# EAGLE design MainBorad_ver2_1 (EAGLE 9.6.2)
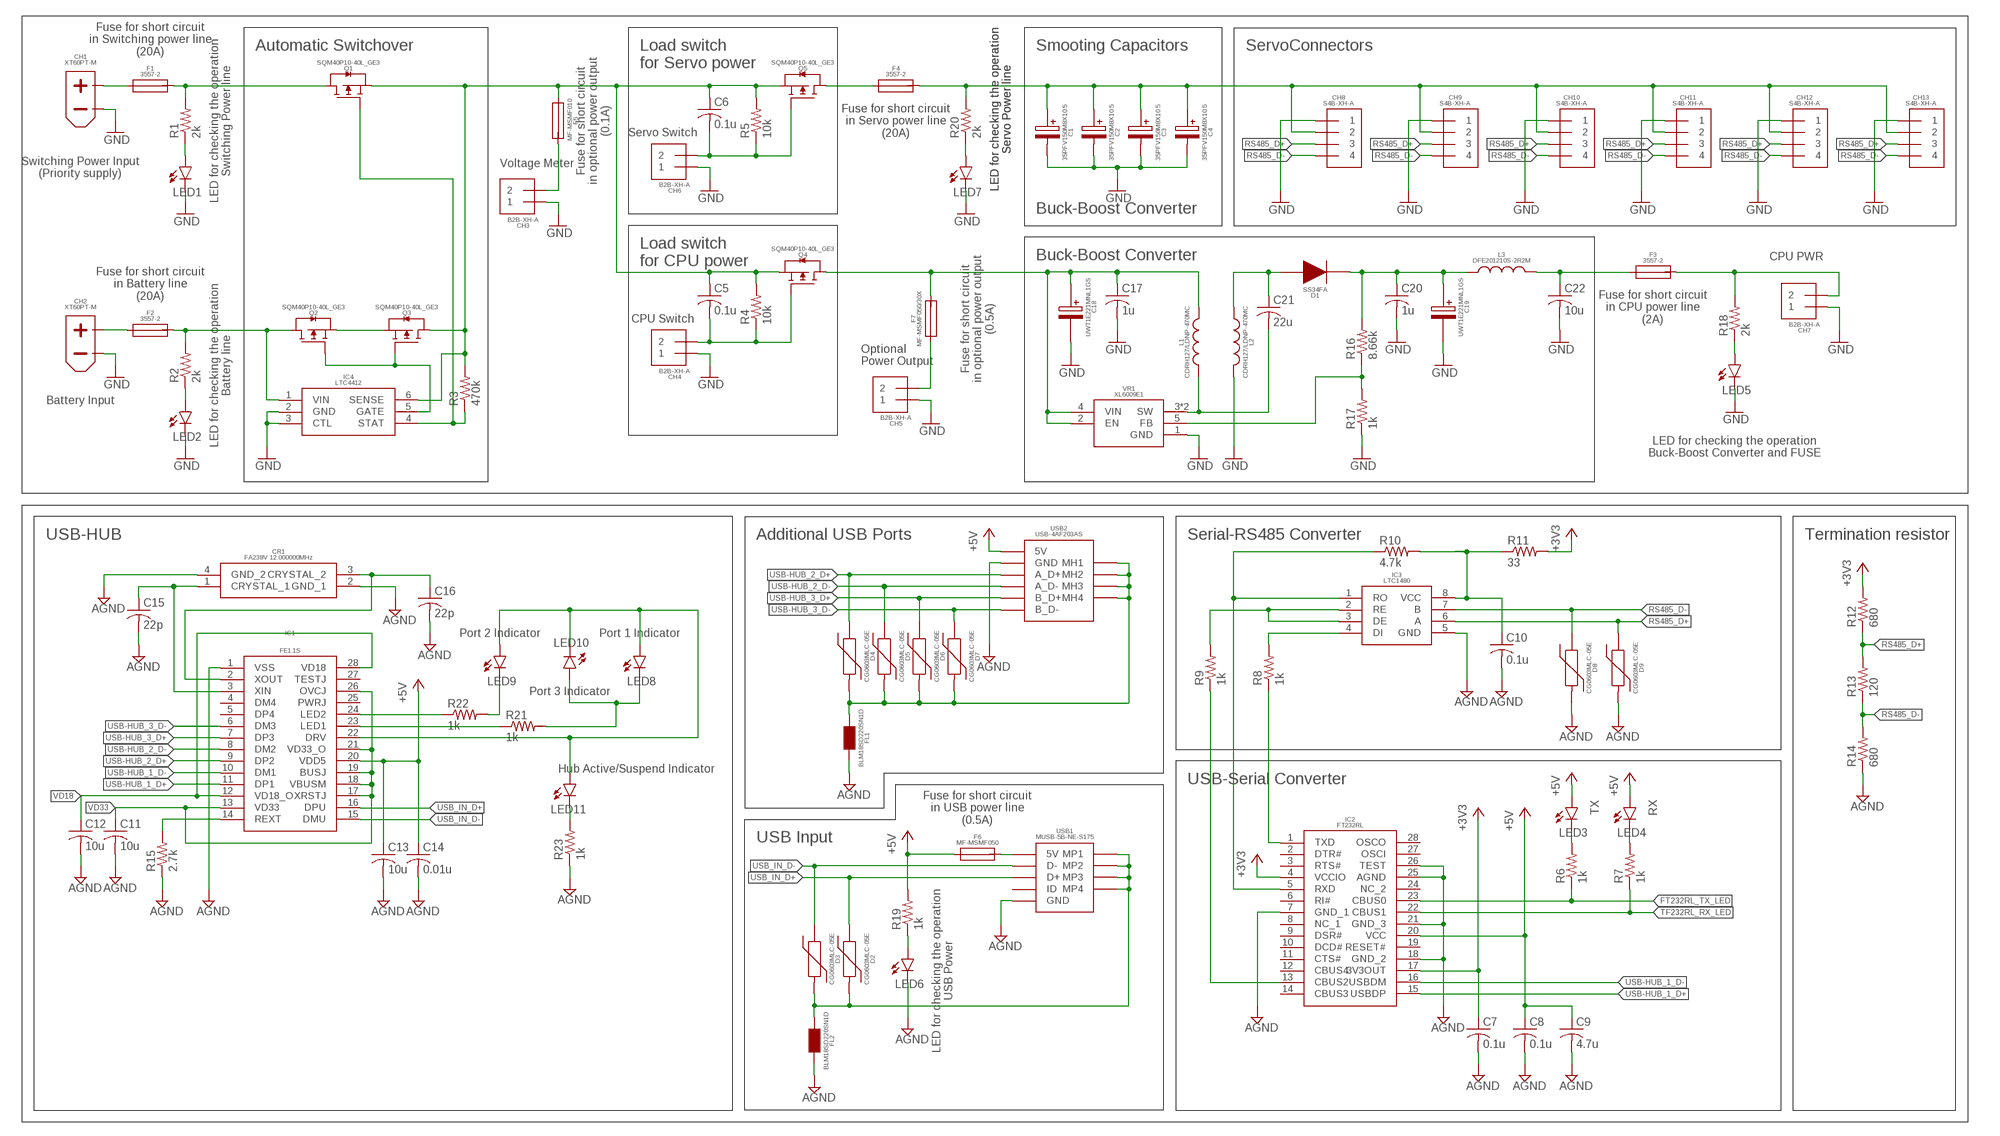
[diagram p0: schematic, sheet 1]

## Parts
C1  35PFV150M8X10.5  [35PFV150M8X10.5]
C2  35PFV150M8X10.5  [35PFV150M8X10.5]
C3  35PFV150M8X10.5  [35PFV150M8X10.5]
C4  35PFV150M8X10.5  [35PFV150M8X10.5]
C5  0.1u  C-USC0603  [C0603]
C6  0.1u  C-USC0603  [C0603]
C7  0.1u  C-USC0603  [C0603]
C8  0.1u  C-USC0603  [C0603]
C9  4.7u  C-USC0603  [C0603]
C10  0.1u  C-USC0603  [C0603]
C11  10u  C-USC0603  [C0603]
C12  10u  C-USC0603  [C0603]
C13  10u  C-USC0603  [C0603]
C14  0.01u  C-USC0603  [C0603]
C15  22p  C-USC0603  [C0603]
C16  22p  C-USC0603  [C0603]
C17  1u  C-USC0603  [C0603]
C18  UWT1E221MNL1GS  [UWT1E221MNL1GS]
C19  UWT1E221MNL1GS  [UWT1E221MNL1GS]
C20  1u  C-USC0603  [C0603]
C21  22u  C-USC2012  [C2012]
C22  10u  C-USC0603  [C0603]
CH1  XT60PT-M  [XT60PT-M]
CH2  XT60PT-M  [XT60PT-M]
CH3  B2B-XH-A  [B2B-XH-A]
CH4  B2B-XH-A  [B2B-XH-A]
CH5  B2B-XH-A  [B2B-XH-A]
CH6  B2B-XH-A  [B2B-XH-A]
CH7  B2B-XH-A  [B2B-XH-A]
CH8  S4B-XH-A  [S4B-XH-A]
CH9  S4B-XH-A  [S4B-XH-A]
CH10  S4B-XH-A  [S4B-XH-A]
CH11  S4B-XH-A  [S4B-XH-A]
CH12  S4B-XH-A  [S4B-XH-A]
CH13  S4B-XH-A  [S4B-XH-A]
CR1  FA238V_12.000000MHZ  [FA238V]
D1  SS34FA  [SS34FA]
D2  CG0603MLC-05E  [CG0603MLC-05E]
D3  CG0603MLC-05E  [CG0603MLC-05E]
D4  CG0603MLC-05E  [CG0603MLC-05E]
D5  CG0603MLC-05E  [CG0603MLC-05E]
D6  CG0603MLC-05E  [CG0603MLC-05E]
D7  CG0603MLC-05E  [CG0603MLC-05E]
D8  CG0603MLC-05E  [CG0603MLC-05E]
D9  CG0603MLC-05E  [CG0603MLC-05E]
F1  3557-2  [3557-2]
F2  3557-2  [3557-2]
F3  3557-2  [3557-2]
F4  3557-2  [3557-2]
F5  MF-MSMF010  [MF-MSMF010]
F6  MF-MSMF050  [MF-MSMF050]
F7  MF-MSMF050/30X  [MF-MSMF050]
FL1  BLM18SD220SN1D  [BLM18SD220SN1D]
FL2  BLM18SD220SN1D  [BLM18SD220SN1D]
IC1  FE1.1S  [FE1.1S]
IC2  FT232RL  [FT232RL]
IC3  LTC1480  [LTC1480]
IC4  LTC4412  [LTC4412]
L1  CDRH127/LDNP-470MC  [CDRH127/LDNP]
L2  CDRH127/LDNP-470MC  [CDRH127/LDNP]
L3  DFE201210S-2R2M  [DFE201210S]
LED1  LEDSML0603  [SML0603]
LED2  LEDSML0603  [SML0603]
LED3  LEDSML0603  [SML0603]
LED4  LEDSML0603  [SML0603]
LED5  LEDSML0603  [SML0603]
LED6  LEDSML0603  [SML0603]
LED7  LEDSML0603  [SML0603]
LED8  LEDSML0603  [SML0603]
LED9  LEDSML0603  [SML0603]
LED10  LEDSML0603  [SML0603]
LED11  LEDSML0603  [SML0603]
Q1  SQM40P10-40L_GE3  [TO-252-3]
Q2  SQM40P10-40L_GE3  [TO-252-3]
Q3  SQM40P10-40L_GE3  [TO-252-3]
Q4  SQM40P10-40L_GE3  [TO-252-3]
Q5  SQM40P10-40L_GE3  [TO-252-3]
R1  2k  R-US_R0603  [R0603]
R2  2k  R-US_R0603  [R0603]
R3  470k  R-US_R0603  [R0603]
R4  10k  R-US_R0603  [R0603]
R5  10k  R-US_R0603  [R0603]
R6  1k  R-US_R0603  [R0603]
R7  1k  R-US_R0603  [R0603]
R8  1k  R-US_R0603  [R0603]
R9  1k  R-US_R0603  [R0603]
R10  4.7k  R-US_R0603  [R0603]
R11  33  R-US_R0603  [R0603]
R12  680  R-US_R0603  [R0603]
R13  120  R-US_R0603  [R0603]
R14  680  R-US_R0603  [R0603]
R15  2.7k  R-US_R0603  [R0603]
R16  8.66k  R-US_R0603  [R0603]
R17  1k  R-US_R0603  [R0603]
R18  2k  R-US_R0603  [R0603]
R19  1k  R-US_R0603  [R0603]
R20  2k  R-US_R0603  [R0603]
R21  1k  R-US_R0603  [R0603]
R22  1k  R-US_R0603  [R0603]
R23  1k  R-US_R0603  [R0603]
USB1  MINI_USB_5P_B_TYPE  [MINI_USB_5P_B_TYPE]
USB2  USB_4P_A_TYPE_X2  [USB_4P_A_TYPE_X2]
VR1  XL6009E1  [TO263-5L]

## Nets
+3V3 [USB-Power]: C7.1 IC2.4(VCCIO) IC2.17(3V3OUT) R11.2 R12.2
+5V [USB-Power]: C8.1 C9.1 C13.1 C14.1 F6.1 IC1.20(VDD5) IC2.20(VCC) LED3.A LED4.A R19.2 USB2.4(5V) USB2.8(5V)
A_DIODE_DCDC [DCDC-Power]: C19.+ C20.1 D1.1 L3.1 R16.2
A_FUSE_BATT [Battery-Power]: F2.3 F2.4 IC4.1(VIN) Q2.4(D) R2.2
A_FUSE_DCDC [DCDC-Power]: CH7.2 F3.3 F3.4 R18.2
A_FUSE_METER [Meter]: CH3.2 F5.2
A_FUSE_PWR [Battery-Power]: F1.3 F1.4 Q1.4(D) R1.2
A_FUSE_SERVO [Battery-Power]: C1.+ C2.+ C3.+ C4.+ CH8.2 CH9.2 CH10.2 CH11.2 CH12.2 CH13.2 F4.3 F4.4 R20.2
AGND [USB-Power]: C7.2 C8.2 C9.2 C10.2 C11.2 C12.2 C13.2 C14.2 C15.2 C16.2 CR1.2(GND_1) CR1.4(GND_2) D8.2 D9.2 FL1.2 FL2.2 IC1.1(VSS) IC2.7(GND_1) IC2.18(GND_2) IC2.21(GND_3) IC2.25(AGND) IC2.26(TEST) IC3.5(GND) LED6.C R14.1 R15.1 R23.1 USB1.5(GND) USB2.1(GND) USB2.5(GND)
B_DIODE_DCDC [DCDC-Power]: C21.1 D1.2 L2.1
B_FUSE_BATT [FUSE-Power]: CH2.+ F2.1 F2.2
B_FUSE_DCDC [DCDC-Power]: C22.1 F3.1 F3.2 L3.2
B_FUSE_PWR [FUSE-Power]: CH1.+ F1.1 F1.2
B_FUSE_SERVO [Battery-Power]: F4.1 F4.2 Q5.4(D)
B_FUSE_USB_MINI_B [USB-Power]: F6.2 USB1.1(5V)
B_LOAD_CPU [Power_Switching]: C5.2 CH4.2 Q4.1(G) R4.1
B_LOAD_SERVO [Power_Switching]: C6.2 CH6.2 Q5.1(G) R5.1
CPU_PWR_IN [CPU-Power]: C17.1 C18.+ F7.2 L1.2 Q4.4(D) VR1.2(EN) VR1.4(VIN)
EN [USB-Data]: IC3.2(RE) IC3.3(DE) R9.2
FB_DCDC [DCDC-Power]: R16.1 R17.2 VR1.5(FB)
FE1.1S_DRV [USB-Power]: IC1.22(DRV) LED8.A LED9.A LED10.C LED11.A
FE1.1S_DRV_LED_A [USB-Power]: LED11.C R23.2
FE1.1S_LED1_A [USB-Power]: LED8.C LED10.A R21.2
FE1.1S_LED_1_B [USB-Power]: IC1.23(LED1) R21.1
FE1.1S_LED_2_A [USB-Power]: LED9.C R22.2
FE1.1S_LED_2_B [USB-Power]: IC1.24(LED2) R22.1
FT232RL_CBUS2 [USB-Data]: IC2.13(CBUS2) R9.1
FT232RL_RXD [USB-Data]: IC2.5(RXD) IC3.1(RO) R10.1
FT232RL_TX_LED [USB-Power]: IC2.23(CBUS0) R6.1
FT232RL_TXD [USB-Data]: IC2.1(TXD) R8.1
GND [Battery-Power]: C1.- C2.- C3.- C4.- C17.2 C18.- C19.- C20.2 C22.2 CH1.- CH2.- CH3.1 CH4.1 CH5.1 CH6.1 CH7.1 CH8.1 CH9.1 CH10.1 CH11.1 CH12.1 CH13.1 IC4.2(GND) IC4.3(CTL) L2.2 LED1.C LED2.C LED5.C LED7.C R17.1 VR1.1(GND)
INPUT_PWR [Battery-Power]: C5.1 C6.1 F5.1 IC4.6(SENSE) Q1.3(S) Q3.4(D) Q4.3(S) Q5.3(S) R3.2 R4.2 R5.2
LED_BATT [LED]: LED2.A R2.1
LED_DCDCOUT [LED]: LED5.A R18.1
LED_FT232RL_RX [USB-Power]: LED4.C R7.2
LED_FT232RL_TX [USB-Power]: LED3.C R6.2
LED_PWR [LED]: LED1.A R1.1
LED_SERVO [LED]: LED7.A R20.1
LED_USBIN [USB-Power]: LED6.A R19.1
LTC1480_DI [USB-Data]: IC3.4(DI) R8.2
LTC1480_VCC [USB-Power]: C10.1 IC3.8(VCC) R10.2 R11.1
LTC4412_GATE [Power_Switching]: IC4.5(GATE) Q2.1(G) Q3.1(G)
LTC4412_STAT [Power_Switching]: IC4.4(STAT) Q1.1(G) R3.1
POWER_OUTPUT [PowerOutput]: CH5.2 F7.1
REXT_FE1.1S [USB-Data]: IC1.14(REXT) R15.2
RS485_D+ [USB-Data]: CH8.3 CH9.3 CH10.3 CH11.3 CH12.3 CH13.3 D9.1 IC3.6(A) R12.1 R13.2
RS485_D- [USB-Data]: CH8.4 CH9.4 CH10.4 CH11.4 CH12.4 CH13.4 D8.1 IC3.7(B) R13.1 R14.2
SOURCE [Battery-Power]: Q2.3(S) Q3.3(S)
SW_DCDC [DCDC-Power]: C21.2 L1.1 VR1.3(SW) VR1.6(SW)
TF232RL_RX_LED [USB-Power]: IC2.22(CBUS1) R7.1
USB-HUB_1_D+ [USB-Data]: IC1.11(DP1) IC2.15(USBDP)
USB-HUB_1_D- [USB-Data]: IC1.10(DM1) IC2.16(USBDM)
USB-HUB_2_D+ [USB-Data]: D4.1 IC1.9(DP2) USB2.2(A_D+)
USB-HUB_2_D- [USB-Data]: D5.1 IC1.8(DM2) USB2.3(A_D-)
USB-HUB_3_D+ [USB-Data]: D6.1 IC1.7(DP3) USB2.6(B_D+)
USB-HUB_3_D- [USB-Data]: D7.1 IC1.6(DM3) USB2.7(B_D-)
USB_A_SHIELD [USB-Power]: D4.2 D5.2 D6.2 D7.2 FL1.1 USB2.MH1 USB2.MH2 USB2.MH3 USB2.MH4
USB_IN_D+ [USB-Data]: D2.1 IC1.16(DPU) USB1.3(D+)
USB_IN_D- [USB-Data]: D3.1 IC1.15(DMU) USB1.2(D-)
USB_MINI_B_SHIELD [USB-Power]: D2.2 D3.2 FL2.1 USB1.MP1 USB1.MP2 USB1.MP3 USB1.MP4
VD18 [USB-Power]: C12.1 IC1.12(VD18_O) IC1.28(VD18)
VD33 [USB-Power]: C11.1 IC1.13(VD33) IC1.17(XRSTJ) IC1.18(VBUSM) IC1.19(BUSJ) IC1.21(VD33_O) IC1.26(OVCJ)
XIN_FE1.1S [USB-Data]: C15.1 CR1.1(CRYSTAL_1) IC1.3(XIN)
XOUT_FE1.1S [USB-Data]: C16.1 CR1.3(CRYSTAL_2) IC1.2(XOUT)
Unconnected: IC1.4(DM4) IC1.5(DP4) IC1.25(PWRJ) IC1.27(TESTJ) IC2.2(DTR#) IC2.3(RTS#) IC2.6(RI#) IC2.8(NC_1) IC2.9(DSR#) IC2.10(DCD#) IC2.11(CTS#) IC2.12(CBUS4) IC2.14(CBUS3) IC2.19(RESET#) IC2.24(NC_2) IC2.27(OSCI) IC2.28(OSCO) USB1.4(ID)

## Notes on the sheet
- Fuse for short circuit
  in Switching power line
  (20A)
- Automatic Switchover
- Load switch
  for Servo power
- Smooting Capacitors | ServoConnectors
- LED for checking the operation
  Servo Power line
- LED for checking the operation
  Servo Power line
- LED for checking the operation
  Switching Power line
- Fuse for short circuit
  in optional power output
  (0.1A)
- Fuse for short circuit
  in Servo power line
  (20A)
- Servo Switch
- Switching Power Input
  (Priority supply)
- Voltage Meter
- Buck-Boost Converter
- Load switch
  for CPU power
- Buck-Boost Converter
- CPU PWR
- Fuse for short circuit
  in Battery line
  (20A)
- Fuse for short circuit
  in CPU power line
  (2A)
- CPU Switch
- Fuse for short circuit
  in optional power output
  (0.5A)
- LED for checking the operation
  Battery line
- Optional
  Power Output
- Battery Input
- LED for checking the operation
  Buck-Boost Converter and FUSE
- USB-HUB | Additional USB Ports | Serial-RS485 Converter | Termination resistor
- Port 2 Indicator | Port 1 Indicator
- Port 3 Indicator
- Hub Active/Suspend Indicator | USB-Serial Converter
- Fuse for short circuit
  in USB power line
  (0.5A)
- TX | RX
- USB Input
- LED for checking the operation
  USB Power

## Library data of the parts
C1-C4 = 35PFV150M8X10.5:35PFV150M8X10.5
C5-C17 C20-C22 = rcl:C-US: CAPACITOR, American symbol; SPICEPREFIX: C
C18 C19 = UWT1E221MNL1GS:UWT1E221MNL1GS
CH1 CH2 = AMASS_XT60:XT60PT-M
CH3-CH7 = JST-XH:B2B-XH-A
CH8-CH13 = JST-XH:S4B-XH-A
CR1 = FA238V:FA238V_12.000000MHZ
D1 = SS34FA:SS34FA
D2-D9 = CG0603MLC-05E:CG0603MLC-05E
F1-F4 = 3557-2:3557-2
F5 = MF-MSMF:MF-MSMF010
F6 = MF-MSMF:MF-MSMF050
F7 = MF-MSMF:MF-MSMF050/30X
FL1 FL2 = BLM18SD220SN1D:BLM18SD220SN1D
IC1 = FE1.1S:FE1.1S
IC2 = FT232RL:FT232RL
IC3 = LTC1480:LTC1480
IC4 = LTC4412:LTC4412
L1 L2 = CDRH127_LDNP:CDRH127/LDNP-470MC
L3 = DFE201210S:DFE201210S-2R2M
LED1-LED11 = led:LED: LED OSRAM: - CHIPLED LG R971, LG N971, LY N971, LG Q971, LY Q971, LO R971, LY R971 LH N974, LH R974 LS Q976, LO Q976, LY Q976 LO Q996 - Hyper CHIPLED LW Q18S LB Q993, LB Q99A, LB R99A - SideLED LS A670, LO A670, LY A670, LG A670, LP A670 LB A673, LV A673, LT A673, LW A673 LH A674 LY A675 LS A676, LA A676, LO A676, LY A676, LW A676 LS A679, LY A679, LG A679 - Hyper Micro SIDELED® LS Y876, LA Y876, LO Y876, LY Y876 LT Y87S - SmartLED LW L88C, LW L88S LB L89C, LB L89S, LG L890 LS L89K, LO L89K, LY L89K LS L896, LA L896, LO L896, LY L896 - TOPLED LS T670, LO T670, LY T670, LG T670, LP T670 LSG T670, LSP T670, LSY T670, LOP T670, LYG T670 LG T671, LOG T671, LSG T671 LB T673, LV T673, LT T673, LW T673 LH T674 LS T676, LA T676, LO T676, LY T676, LB T676, LH T676, LSB T676, LW T676 LB T67C, LV T67C, LT T67C, LS T67K, LO T67K, LY T67K, LW E67C LS E67B, LA E67B, LO E67B, LY E67B, LB E67C, LV E67C, LT E67C LW T67C LS T679, LY T679, LG T679 LS T770, LO T770, LY T770, LG T770, LP T770 LB T773, LV T773, LT T773, LW T773 LH T774 LS E675, LA E675, LY E675, LS T675 LS T776, LA T776, LO T776, LY T776, LB T776 LHGB T686 LT T68C, LB T68C - Hyper Mini TOPLED® LB M676 - Mini TOPLED Santana® LG M470 LS M47K, LO M47K, LY M47K Source: http://www.osram.convergy.de LUXEON: - LUMILED® LXK2-PW12-R00, LXK2-PW12-S00, LXK2-PW14-U00, LXK2-PW14-V00 LXK2-PM12-R00, LXK2-PM12-S00, LXK2-PM14-U00 LXK2-PE12-Q00, LXK2-PE12-R00, LXK2-PE12-S00, LXK2-PE14-T00, LXK2-PE14-U00 LXK2-PB12-K00, LXK2-PB12-L00, LXK2-PB12-M00, LXK2-PB14-N00, LXK2-PB14-P00, LXK2-PB14-Q00 LXK2-PR12-L00, LXK2-PR12-M00, LXK2-PR14-Q00, LXK2-PR14-R00 LXK2-PD12-Q00, LXK2-PD12-R00, LXK2-PD12-S00 LXK2-PH12-R00, LXK2-PH12-S00 LXK2-PL12-P00, LXK2-PL12-Q00, LXK2-PL12-R00 Source: www.luxeon.com KINGBRIGHT: KA-3528ASYC Source: www.kingbright.com
Q1-Q5 = Vishay_FET:SQM40P10-40L_GE3
R1-R23 = rcl:R-US_: RESISTOR, American symbol; SPICEPREFIX: R
USB1 = USB_Connector:MINI_USB_5P_B_TYPE
USB2 = USB_Connector:USB_4P_A_TYPE_X2
VR1 = XL6009E1:XL6009E1

## Net classes
0 default: width 0.254 mm, drill 0.127 mm, clearance 0.203 mm
1 USB-Data: width 0.203 mm, drill 0.127 mm, clearance 0.203 mm
2 USB-Power: width 0.254 mm, drill 0.127 mm, clearance 0.203 mm
3 CPU-Power: width 2.54 mm, drill 1.27 mm, clearance 0.203 mm
4 Battery-Power: width 2.54 mm, drill 1.27 mm, clearance 0.203 mm
5 FUSE-Power: width 3.048 mm, drill 1.27 mm, clearance 0.203 mm
6 DCDC-Power: width 1.143 mm, drill 0.254 mm, clearance 0.203 mm
7 Power_Switching: width 0.508 mm, drill 0.254 mm, clearance 0.203 mm
8 LED: width 0.254 mm, drill 0.127 mm, clearance 0.203 mm
9 Meter: width 0.508 mm, drill 0.254 mm, clearance 0.203 mm
10 PowerOutput: width 1.143 mm, drill 0.254 mm, clearance 0.203 mm

## Board
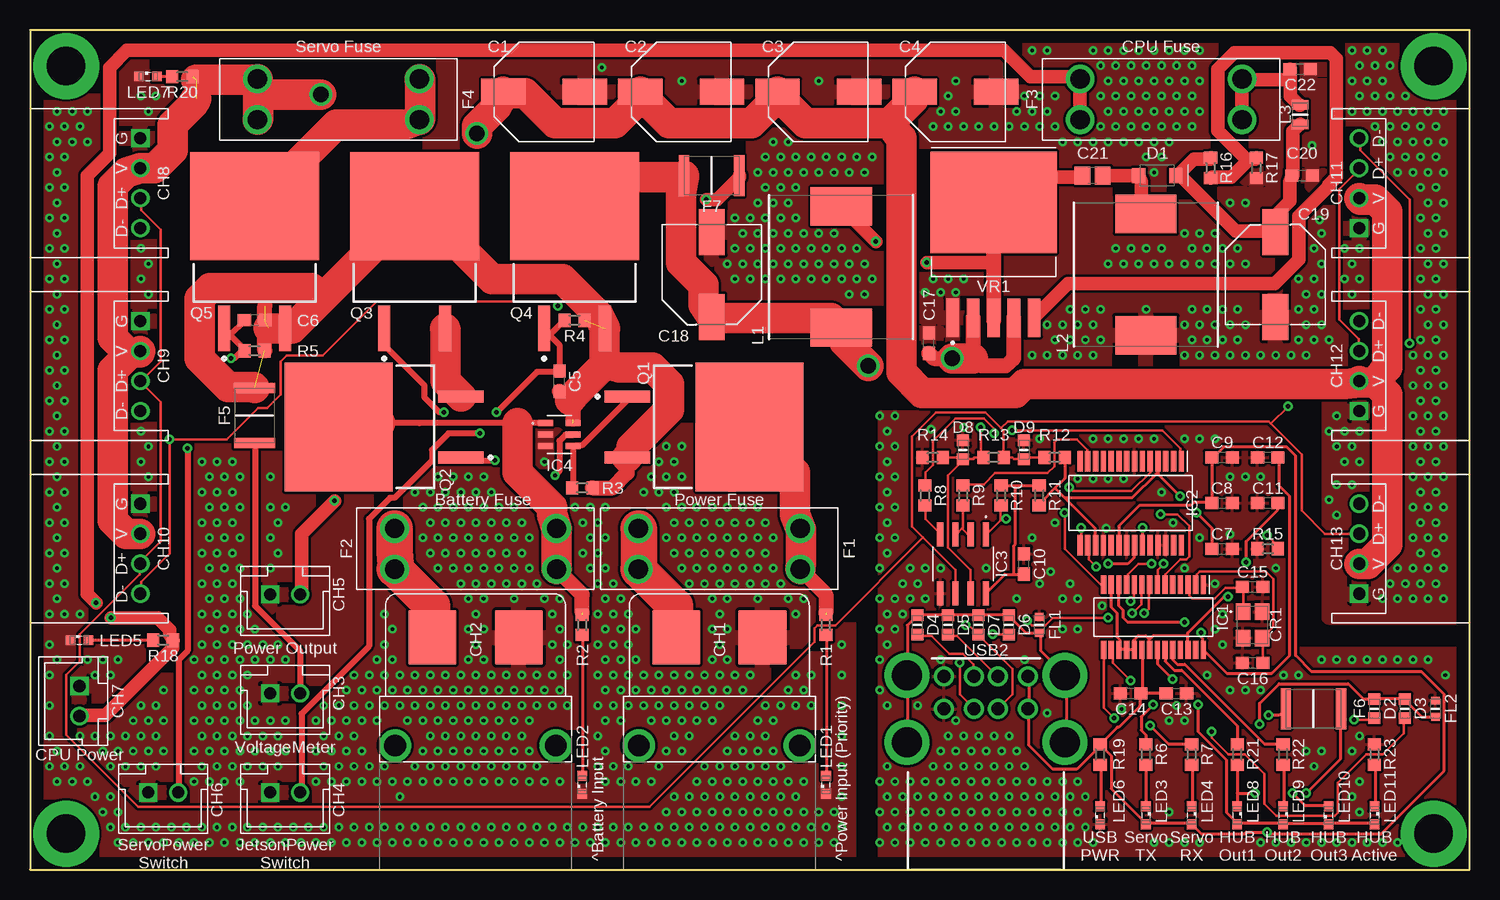
[diagram p1: board, top side]
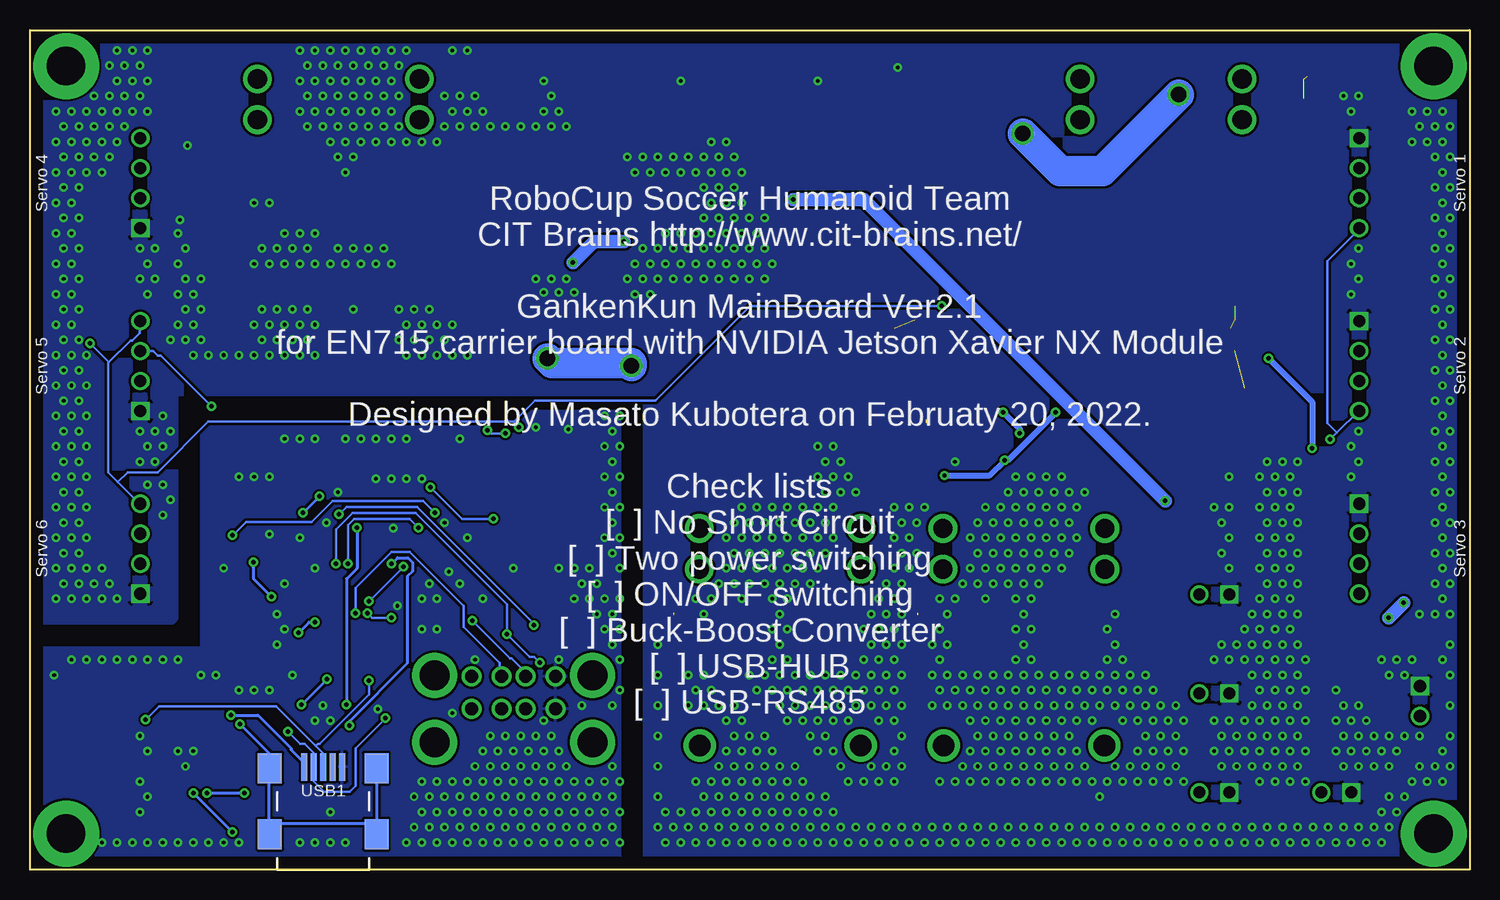
[diagram p2: board, bottom side, seen from below]

Size 120 x 70 mm. Coordinates in mm from the lower left corner, seen from the top.
Outline: 0,70 0,0 120,0 120,70 0,70
Copper layers (1*16): Top 0.035mm / dielectric 1.5mm / Bottom 0.035mm
Design rules "default": minimum track width 6mil, minimum drill 0.35mm, track to track 6mil, track to pad 6mil, pad to pad 6mil, via to via 6mil, smd to smd 6mil, copper to edge 40mil, drill to drill 6mil, minimum pad ring 10mil, minimum via ring 8mil, stop-mask expansion 4mil, vias tented up to drill 0mil, thermal gap 10mil

### Footprints (pad centres in the part's own frame; a part is rotated, then mirrored left to right if it is on the bottom)
35PFV150M8X10.5 = smd 3.7 x 2.15: + -3.4,0; - 3.4,0
C0603 = smd 1.1 x 1: 1 -0.85,0; 2 0.85,0
UWT1E221MNL1GS = smd 3.85 x 2.15: + -3.55,0; - 3.55,0
C2012 = smd 1.3 x 1.5: 1 -0.85,0; 2 0.85,0
XT60PT-M = drill 1.8: 1 -6.7,-10.35; 2 6.7,-10.35 | smd 4 x 4.5: + 3.6,-19.35; - -3.6,-19.35
B2B-XH-A = drill 1.016 square: 1 -1.25,0 | drill 1.016: 2 1.25,0
S4B-XH-A = drill 1.016 square: 1 3.75,0 | drill 1.016: 2 1.25,0; 3 -1.25,0; 4 -3.75,0
FA238V = smd 1.4 x 1.2: 1 -1.1,-0.8; 2 1.1,-0.8; 3 1.1,0.8; 4 -1.1,0.8
SS34FA = smd 1.12 x 1.22: 1 -1.55,0; 2 1.55,0
CG0603MLC-05E = smd 0.95 x 1: 1 -0.8,0; 2 0.8,0
3557-2 = drill 1.6: 1 -6.75,1.7; 2 -6.75,-1.7; 3 6.75,1.7; 4 6.75,-1.7
MF-MSMF010 = smd 0.85 x 3.43: 1 -2.3,0; 2 2.3,0
MF-MSMF050 = smd 0.85 x 3.43: 1 -2.3,0; 2 2.3,0
BLM18SD220SN1D = smd 0.65 x 0.7: 1 -0.675,0; 2 0.675,0
FE1.1S = smd 1.525 x 0.44: 1 -2.712,4.16; 2 -2.712,3.52; 3 -2.712,2.88; 4 -2.712,2.24; 5 -2.712,1.6; 6 -2.712,0.96; 7 -2.712,0.32; 8 -2.712,-0.32; 9 -2.712,-0.96; 10 -2.712,-1.6; 11 -2.712,-2.24; 12 -2.712,-2.88; 13 -2.712,-3.52; 14 -2.712,-4.16; 15 2.712,-4.16; 16 2.712,-3.52; 17 2.712,-2.88; 18 2.712,-2.24; 19 2.712,-1.6; 20 2.712,-0.96; 21 2.712,-0.32; 22 2.712,0.32; 23 2.712,0.96; 24 2.712,1.6; 25 2.712,2.24; 26 2.712,2.88; 27 2.712,3.52; 28 2.712,4.16
FT232RL = smd 1.7 x 0.45: 1 -3.5,4.225; 2 -3.5,3.575; 3 -3.5,2.925; 4 -3.5,2.275; 5 -3.5,1.625; 6 -3.5,0.975; 7 -3.5,0.325; 8 -3.5,-0.325; 9 -3.5,-0.975; 10 -3.5,-1.625; 11 -3.5,-2.275; 12 -3.5,-2.925; 13 -3.5,-3.575; 14 -3.5,-4.225; 15 3.5,-4.225; 16 3.5,-3.575; 17 3.5,-2.925; 18 3.5,-2.275; 19 3.5,-1.625; 20 3.5,-0.975; 21 3.5,-0.325; 22 3.5,0.325; 23 3.5,0.975; 24 3.5,1.625; 25 3.5,2.275; 26 3.5,2.925; 27 3.5,3.575; 28 3.5,4.225
LTC1480 = smd 1.981 x 0.533: 1 -2.464,1.905; 2 -2.464,0.635; 3 -2.464,-0.635; 4 -2.464,-1.905; 5 2.464,-1.905; 6 2.464,-0.635; 7 2.464,0.635; 8 2.464,1.905
LTC4412 = smd 1.219 x 0.508: 1 -1.143,0.95; 2 -1.143,0; 3 -1.143,-0.95; 4 1.143,-0.95; 5 1.143,0; 6 1.143,0.95
CDRH127/LDNP = smd 3.2 x 5.1: 1 -5.05,0; 2 5.05,0
DFE201210S = smd 0.8 x 1.4: 1 -0.8,0; 2 0.8,0
SML0603 = smd 0.8 x 0.8: A 0.75,0; C -0.75,0
TO-252-3 = smd 3.8 x 1: 1 -6.4,2.54; 3 -6.4,-2.54 | smd 9 x 10.75: 4 3.8,0
R0603 = smd 1 x 1.1: 1 -0.85,0; 2 0.85,0
MINI_USB_5P_B_TYPE = smd 0.5 x 2.3: 1 -1.6,8.55; 2 -0.8,8.55; 3 0,8.55; 4 0.8,8.55; 5 1.6,8.55 | smd 2 x 2.5: MP1 -4.45,8.45; MP2 4.45,8.45; MP3 4.45,2.95; MP4 -4.45,2.95
USB_4P_A_TYPE_X2 = drill 1.1 pad 1.65: 1 -3.5,16.11; 2 -1,16.11; 3 1,16.11; 4 3.5,16.11; 5 -3.5,13.4; 6 -1,13.4; 7 1,13.4; 8 3.5,13.4 | drill 2.5 pad 3.75: MH1 -6.57,16.2; MH2 6.57,16.2; MH3 -6.57,10.6; MH4 6.57,10.6
TO263-5L = smd 3.21 x 1.05: 1 -6.13,3.4; 2 -6.13,1.7; 3 -6.13,0; 4 -6.13,-1.7; 5 -6.13,-3.4 | smd 8.46 x 10.53: 6 3.5,0

### Placement (x,y rotation side)
C1  42.86,64.84 0 top
C2  54.28,64.84 0 top
C3  65.72,64.84 0 top
C4  77.14,64.84 0 top
C5  44.12,40.72 90 top
C6  18.73,45.8 180 top
C7  99.37,26.74 0 top
C8  99.37,30.55 0 top
C9  99.37,34.37 0 top
C10  82.86,25.48 90 top
C11  103.18,30.55 180 top
C12  103.18,34.37 180 top
C13  95.56,14.68 0 top
C14  91.75,14.68 180 top
C15  101.91,23.57 0 top
C16  101.91,17.22 180 top
C17  74.92,43.89 90 top
C18  56.83,49.61 90 top
C19  103.81,49.61 270 top
C20  106.04,57.86 0 top
C21  88.58,57.86 180 top
C22  105.88,66.75 0 top
CH1  57.46,0 180 top
CH2  37.14,0 180 top
CH3  21.27,14.68 0 top
CH4  21.27,6.43 0 top
CH5  21.27,22.94 0 top
CH6  11.1,6.43 0 top
CH7  4.12,14.05 270 top
CH8  9.2,57.23 90 top
CH9  9.2,41.98 90 top
CH10  9.2,26.74 90 top
CH11  110.8,57.23 270 top
CH12  110.8,41.98 270 top
CH13  110.8,26.74 270 top
CR1  101.91,20.39 270 top
D1  93.97,57.86 180 top
D2  112.07,13.41 90 top
D3  114.61,13.41 90 top
D4  73.97,20.39 90 top
D5  76.51,20.39 90 top
D6  81.59,20.39 90 top
D7  79.05,20.39 90 top
D8  77.78,35 90 top
D9  82.86,35 90 top
F1  57.46,26.74 0 top
F2  37.14,26.74 0 top
F3  94.29,64.21 180 top
F4  25.71,64.21 180 top
F5  18.73,37.86 270 top
F6  106.99,13.41 180 top
F7  56.83,57.86 180 top
FL1  84.13,20.39 90 top
FL2  117.15,13.41 90 top
IC1  93.66,21.03 270 top
IC2  91.75,30.55 270 top
IC3  77.78,25.48 270 top
IC4  44.12,36.27 0 top
L1  67.62,50.24 270 top
L2  93.02,49.61 270 top
L3  105.88,62.94 90 top
LED1  66.35,7.06 90 top
LED2  46.03,7.06 90 top
LED3  93.02,4.52 270 top
LED4  96.83,4.52 270 top
LED5  4.12,19.12 0 top
LED6  89.21,4.52 90 top
LED7  9.84,66.11 0 top
LED8  100.64,4.52 270 top
LED9  104.45,4.52 270 top
LED10  108.26,4.52 90 top
LED11  112.07,4.52 270 top
Q1  56.19,36.91 0 top
Q2  29.52,36.91 180 top
Q3  32.06,51.51 90 top
Q4  45.39,51.51 90 top
Q5  18.73,51.51 90 top
R1  66.35,20.39 90 top
R2  46.03,20.39 90 top
R3  46.03,31.82 0 top
R4  45.39,45.8 0 top
R5  18.73,43.26 0 top
R6  93.02,9.6 270 top
R7  96.83,9.6 270 top
R8  74.61,31.19 270 top
R9  77.78,31.19 270 top
R10  80.95,31.19 90 top
R11  84.13,31.19 270 top
R12  85.4,34.37 0 top
R13  80.32,34.37 0 top
R14  75.24,34.37 0 top
R15  103.18,26.74 0 top
R16  98.42,58.5 90 top
R17  102.23,58.5 90 top
R18  11.1,19.12 0 top
R19  89.21,9.6 90 top
R20  12.69,66.11 0 top
R21  100.64,9.6 270 top
R22  104.45,9.6 270 top
R23  112.07,9.6 270 top
USB1  95.56,0 0 bottom
USB2  79.69,0 0 top
VR1  80.32,52.14 90 top

### Tracks (layer width: path | path; a pad name or v marks a point on that pad's centre or on a via)
+3V3  (via drill 0.35)
  Top 0.254: v97.25,29.75 98.5,28.5 98.5,26.75 C7.1 | 94,33 v95.88,31.12 | 94,33 94,34 IC2.4 | 85.44,31.81 86.25,32.62 R12.2 | 85.44,31.81 84.25,30.62 84.25,30.38 R11.2 | 85.44,31.81 86.21,31.04 | 86.21,31.04 88.75,28.5 88.75,27.12 IC2.17 | 86.21,31.04 91.91,31.04 93.88,33 94,33
  Bottom 0.254: v95.88,31.12 v97.25,29.75
+5V  (via drill 0.35)
  Top 0.254: IC2.20 90.75,27.12 90.75,28.63 92.49,30.38 96.75,30.38 97,30.62 98.38,30.62 C8.1 98.5,30.62 98.5,34.25 C9.1 98.62,34.38 99.5,35.25 104.75,35.25 105.5,34.5 105.5,17.84 106.84,16.5 116,16.5 117.88,14.62 117.88,8.25 112.62,3 103.12,3 v103.12,3.12 101.38,3.12 101.25,3 97.62,3 96.88,3.75 LED4.A 96.75,3.88 93.12,3.88 LED3.A 93,3.88 90.12,6.75 90.12,9.5 89.25,10.38 | USB2.4 83.25,16 83.25,13.5 USB2.8 83.25,13.38 83.25,10.38 85.25,8.38 87.25,8.38 89.25,10.38 | C14.1 92.5,14.62 92.5,13.62 90.75,11.88 90.62,11.88 89.25,10.5 R19.2 89.25,10.38 | C13.1 94.62,14.75 92.62,14.75 C14.1 | IC1.20 92.75,18.25 92.75,14.88 C14.1 | v106.38,6.38 109.25,9.25 109.25,13.38 F6.1
  Bottom 0.254: v103.12,3.12 v106.38,6.38
A_DIODE_DCDC
  Top 1.143: L3.1 105.83,62.12 105.25,61.54 105.25,57.88 C20.1 105,57.38 105,55.75 104,54.75 104,53.75 C19.+ 103.75,53.25 100.5,53.25 95.75,58 | 95.75,58 95.62,57.88 D1.1 | 95.75,58 97,59.25 98.38,59.25 R16.2
A_FUSE_BATT  (1 unrouted)
  Top 0.508: IC4.1 40.62,37.22 32.45,37.22 29.2,37.22
  Top 1.27: 46.03,21.4 46.03,22.94 F2.4
  Top 2.54: F2.4 43.88,25.62 43.88,28.38 F2.3 43.5,29.62 43.5,30.25 40.62,33.12 40.62,37.22 | 29.2,37.22 29,37.12 25.88,37.12 25.75,37 Q2.4
A_FUSE_DCDC  (via drill 0.35)
  Top 1.143: F3.3 87.5,62.62 87.5,65.88 F3.4 87,66.12 83.38,66.12 81.18,68.32 8.07,68.32 6.62,66.88 6.62,59.75 4.75,57.88 4.75,23 v5.5,22.25 | CH7.2 4.12,12.88 6.25,12.88 11.88,18.5 11.88,19.12 R18.2 11.62,19.62 11.62,20 10.62,21 v6.75,21
  Bottom 1.143: v6.75,21 v5.5,22.25
A_FUSE_METER
  Top 0.508: CH3.2 22.5,14.75 22.5,18.25 18.75,22 18.75,35.5 F5.2
A_FUSE_PWR  (1 unrouted)
  Top 1.27: F1.4 66.35,22.94 66.35,21.4
  Top 2.54: F1.4 64.25,25.62 64.25,28.38 F1.3 63.75,29.62 63.75,33.12 60,36.88 Q1.4
A_FUSE_SERVO  (via drill 1.27)  (2 unrouted)
  Top 2.54: 8.25,43 8.38,43.12 9.12,43.12 CH9.2 | 8.25,43 6.88,41.62 6.88,29.12 8,28 9.12,28 CH10.2 | 18.88,65.88 13.86,65.88 | 18.88,65.88 F4.4 | 13.86,64.28 13.52,63.75 11.88,62.11 11.88,60 10.38,58.5 9.25,58.5 CH8.2 8,58.12 6.88,57 6.88,44.38 8.25,43 | 19,64.62 19,62.62 F4.3 | 19,64.62 18.88,65.88 | 112.12,40.62 113.12,39.62 113.12,27.12 111.5,25.5 110.88,25.5 CH13.2 | 110.88,40.62 112.12,40.62 | 110.88,40.62 CH12.2 | CH11.2 110.88,55.88 112.12,55.88 113.12,54.88 113.12,41.88 112.88,41.62 112.12,40.62 | 39.5,64.75 41.25,64.75 43.75,62.25 48.75,62.25 50.88,64.38 | 50.88,64.38 50.88,64.75 C2.+ | 39.5,64.75 C1.+ | 62.25,64.38 62.25,64.75 C3.+ | 62.25,64.38 60.12,62.25 53.25,62.25 51.88,63.62 50.88,64.38 | 71.62,62.25 73.62,64.25 73.62,64.75 C4.+ | 71.62,62.25 64.62,62.25 63.25,63.62 62.25,64.38 | 110.88,40.62 109.62,40.5 82.88,40.5 82.12,39.75 74.36,39.75 72.62,41.48 72.62,61 72.38,61.25 71.62,62.25 | v24.25,64.62 19,64.62 | v37.25,61.38 37.25,62 38.88,63.62 39.5,64.75
  Bottom 2.54: v24.25,64.62 30.62,58.25 34.12,58.25 v37.25,61.38
AGND  (via drill 0.3)
  other vias: 85.08,24.84 89.37,21.98 70.83,2.25 71.47,3.52 70.83,4.79 71.47,6.06 70.83,7.33 71.47,8.6 71.47,13.68 70.83,14.95 70.83,17.49 71.47,18.76 70.83,20.03 71.47,21.3 70.83,22.57 72.1,2.25 72.74,3.52 72.1,4.79 72.74,6.06 72.1,7.33 72.1,20.03 72.74,21.3 72.1,22.57 72.74,23.84 73.37,2.25 74.01,3.52 73.37,4.79 74.01,6.06 73.37,7.33 74.01,13.68 73.37,22.57 74.01,23.84 73.37,25.11 74.64,2.25 75.28,3.52 74.64,4.79 75.28,6.06 74.64,7.33 75.28,8.6 74.64,22.57 74.64,25.11 75.12,36.7 75.91,2.25 76.55,3.52 75.91,4.79 76.55,6.06 75.91,7.33 76.55,8.6 75.91,9.87 76.55,11.14 75.91,17.49 75.91,25.11 77.18,2.25 77.82,3.52 77.18,4.79 77.82,6.06 77.18,7.33 77.82,8.6 77.18,9.87 77.82,11.14 77.18,12.41 77.82,36.86 78.45,2.25 79.09,3.52 78.45,4.79 79.09,6.06 78.45,7.33 79.09,8.6 78.45,9.87 79.09,11.14 79.72,2.25 80.36,3.52 79.72,4.79 80.36,6.06 79.72,7.33 80.36,8.6 79.72,9.87 80.36,11.14 80.99,2.25 81.63,3.52 80.99,4.79 81.63,6.06 80.99,7.33 81.63,8.6 80.99,9.87 81.63,11.14 82.26,2.25 82.9,3.52 82.26,4.79 82.9,6.06 82.26,7.33 82.9,8.6 82.26,9.87 82.26,22.57 83.53,2.25 84.17,3.52 83.53,4.79 84.17,6.06 83.53,7.33 84.17,23.84 83.53,27.65 84.8,2.25 85.44,3.52 84.8,4.79 85.44,6.06 84.8,7.33 85.44,28.92 84.17,35.91 86.07,2.25 86.71,3.52 86.07,4.79 86.71,6.06 86.07,7.33 86.07,22.57 86.71,23.84 87.34,2.25 87.98,3.52 87.34,4.79 87.98,6.06 87.34,7.33 87.34,22.57 87.34,32.58 88.61,2.25 88.61,32.58 88.61,35.91 89.88,32.58 89.88,35.91 91.15,32.58 91.15,35.91 92.42,35.91 93.69,2.25 94.33,31.46 93.69,35.91 94.96,2.25 94.96,12.41 95.6,13.68 96.23,2.25 96.23,12.41 96.23,25.11 97.5,2.25 98.14,16.22 97.5,27.65 99.41,18.76 98.77,20.03 99.41,21.3 100.04,14.95 100.04,27.97 100.04,32.73 101.31,14.95 101.31,32.73 102.58,2.25 102.58,14.95 102.58,32.73 103.85,2.25 104.49,16.22 103.85,25.11 105.12,2.25 105.76,16.22 106.39,2.25 107.66,2.25 107.66,17.49 108.93,2.25 108.93,17.49 110.2,2.25 110.2,9.87 110.84,11.14 110.2,17.49 111.47,2.25 111.47,17.49 112.74,2.25 112.74,17.49 114.01,2.25 86.07,20.03 87.34,20.03 98.77,23.84 95.28,28.92 89.73,28.45 70.83,25.11 71.47,26.38 70.83,27.65 71.47,28.92 70.83,30.19 72.1,27.65 72.1,30.19 71.47,36.54 70.83,37.81 72.1,37.81 71.47,31.46 70.83,32.73 71.47,34 70.83,35.27 72.1,32.73 72.1,35.27 94.96,4.79 106.39,9.87 107.66,9.87 107.03,8.6 110.84,7.33 110.2,6.06 110.84,4.79 79.72,25.11 82.9,17.49 84.8,13.05 91,13.37 117.98,16.22 116.55,17.49 114.01,17.49 115.28,17.49 96.23,35.91 97.5,35.91 98.77,35.91
  pour Top: 70.8,-2 70.8,38.17 105.72,38.17 105.72,18.49 122,18.49 122,-2
  pour Bottom: 70.8,-1 70.8,38.17 105.72,38.17 105.72,18.49 121,18.49 121,-1
B_DIODE_DCDC
  Top 1.143: C21.1 89.5,57.88 92.38,57.88 D1.2 92.62,57.38 92.62,55.12 93,54.75 L2.1
B_FUSE_BATT
  Top 3.048: 30.5,25 33.5,22 33.5,19.38 CH2.+ | 30.5,25 F2.2 | F2.1 30.38,28.38 30.38,26.5 30.5,25
B_FUSE_DCDC
  Top 1.143: 105.08,65.88 105.08,64.5 105.83,63.75 L3.2 | 105.08,65.88 105.08,66.75 C22.1 | 105.08,65.88 101.12,65.88 F3.2 101,65.38 101,62.62 F3.1
B_FUSE_PWR
  Top 3.048: 50.75,25 53.75,22 53.75,19.38 CH1.+ | 50.75,25 F1.2 | 50.75,25 50.75,28.38 F1.1
B_FUSE_SERVO
  Top 2.54: F4.2 32.5,65.88 32.5,62.62 F4.1 31.25,62.12 25.5,62.12 18.75,55.38 Q5.4
B_FUSE_USB_MINI_B  (via drill 0.35)
  Top 0.254: v103.25,12.88 104.12,12.88 104.62,13.38 F6.2
  Bottom 0.254: v103.25,12.88 101,12.88 98.25,10.12 98.25,10 97.25,9 97.25,8.62 USB1.1
B_LOAD_CPU  (via drill 0.35)
  Top 0.508: 43.31,44.56 42.88,45 Q4.1 | 43.31,44.56 44.12,43.75 C5.2 43.88,41.5 42.25,41.5 v38.88,38.12 | 43.31,44.56 R4.1 | v37.5,36.38 34.88,36.38 33.5,35 33.5,34.12 30.38,31 30,31 28.25,29.25 28.25,18.62 22.62,13 22.62,6.5 CH4.2
  Bottom 0.508: v37.5,36.38 37.5,36.75 v38.88,38.12
B_LOAD_SERVO  (via drill 0.35)
  Top 0.508: 16.69,44.56 16.25,45 Q5.1 | 16.69,44.56 17.88,43.38 R5.1 17.62,43.25 17,42.62 v16.75,42.62 | 16.69,44.56 17.88,45.75 C6.2 | v13.12,35.12 13.12,18.25 12.38,17.5 12.38,6.5 CH6.2
  Bottom 0.508: v13.12,35.12 13.12,39 v16.75,42.62
CPU_PWR_IN  (via drill 1.27)
  Top 1.27: VR1.4 82.02,42.62 81.32,41.98 79.32,41.98 78.62,42.62 78.62,42.88 VR1.2 | C17.1 75.34,42.62 v76.88,42.62
  Top 2.54: v76.88,42.62 78,42.62 78.62,42.62 | v69.88,42 67.88,44 L1.2 67.5,45.25 66.75,46 56.88,46 C18.+ 56.12,47.12 56.12,48.75 54.25,50.62 54.25,56.5 F7.2 54.5,57.75 47.88,57.75 45.5,55.38 Q4.4
  Bottom 2.54: v76.88,42.62 76.5,42.25 69.88,42.25 v69.88,42
EN
  Top 0.203: 77.69,28.44 77.25,28 IC3.3 | 77.69,28.44 77.75,28.5 77.75,30.25 R9.2 | 77.69,28.44 78.12,28 78.38,28 IC3.2
FB_DCDC
  Top 1.143: 101.5,59.12 101.62,59.25 102.12,59.25 R17.2 | 101.5,59.12 100.12,57.75 98.5,57.75 R16.1 | 101.5,59.12 99,61.62 99,66.75 100.38,68.12 108.38,68.12 108.88,67.62 108.88,57.75 108.25,57.12 108.25,57 105.75,54.5 105.75,50.88 103.75,48.88 86.5,48.88 83.75,46.12 VR1.5
FE1.1S_DRV  (via drill 0.35)
  Top 0.254: LED11.A 112,3.88 108.38,3.88 LED10.C 108.25,3.88 104.5,3.88 LED9.A 104.38,3.88 100.75,3.88 LED8.A 100.62,3.88 99.75,4.75 99.75,9.12 97.38,11.5 v97.38,13.75 | v95.25,15.88 94,17.12 94,18.25 IC1.22
  Bottom 0.254: v97.38,13.75 v95.25,15.88
FE1.1S_DRV_LED_A
  Top 0.254: LED11.C 112.12,5.38 112.12,8.75 R23.2
FE1.1S_LED1_A  (via drill 0.35)
  Top 0.254: 100.62,6.38 100.62,8.75 R21.2 | 100.62,6.38 100.62,5.38 LED8.C | v105.25,6.38 106.25,5.38 108.25,5.38 LED10.A | 100.62,6.38 v102.12,6.38
  Bottom 0.254: v102.12,6.38 v105.25,6.38
FE1.1S_LED_1_B
  Top 0.254: R21.1 100.62,10.5 100.62,12 96,16.62 95.38,16.62 94.62,17.38 94.62,18.25 IC1.23
FE1.1S_LED_2_A
  Top 0.254: LED9.C 104.5,5.38 104.5,8.75 R22.2
FE1.1S_LED_2_B
  Top 0.254: R22.1 104.38,10.5 102.88,10.5 96.25,17.12 95.62,17.12 95.25,17.5 95.25,18.25 IC1.24
FT232RL_CBUS2
  Top 0.203: R9.1 77.88,32.12 79.5,32.12 80.43,33.06 84.82,33.06 85.38,33.62 85.38,35.62 85.62,35.88 87.25,35.88 88.12,35 88.12,34.12 IC2.13
FT232RL_RXD  (via drill 0.35)
  Top 0.203: 80.88,29.25 80.88,29.12 79.75,28 IC3.1 | 80.88,29.25 80.88,30.25 R10.1 | IC2.5 93.38,33.12 91.81,31.56 86.94,31.56 v86.62,31.88 | 80.88,29.25 v81.38,29.25
  Bottom 0.203: v86.62,31.88 84,29.25 v81.38,29.25
FT232RL_TX_LED  (via drill 0.35)
  Top 0.254: v93.62,13.75 92.62,12.75 92.62,11.62 93,11.25 93,10.5 R6.1 | v92.75,28.5 92.75,27.12 IC2.23
  Bottom 0.254: v93.62,13.75 93.62,24.25 92.75,25.12 v92.75,28.5
FT232RL_TXD  (via drill 0.35)
  Top 0.203: v80.38,36.38 80.38,36.75 79.5,37.62 77.12,37.62 75.25,35.75 75.25,33.74 74.62,33.12 74.62,32.12 R8.1 | v81.88,36.62 94.38,36.62 95.88,35.12 95.88,34.12 IC2.1
  Bottom 0.203: v80.38,36.38 81.62,36.38 v81.88,36.62
GND  (via drill 0.3)
  other vias: 1.62,8.6 1.62,11.14 1.62,13.68 1.62,16.22 1.62,18.76 1.62,21.3 1.62,23.84 1.62,26.38 1.62,28.92 1.62,31.46 1.62,34 1.62,36.54 1.62,39.08 1.62,41.62 1.62,44.16 1.62,46.7 1.62,49.24 1.62,51.78 1.62,54.32 1.62,56.86 1.62,59.4 1.62,61.94 2.25,7.33 2.89,8.6 2.25,9.87 2.25,17.49 2.89,21.3 2.25,22.57 2.89,23.84 2.25,25.11 2.89,26.38 2.25,27.65 2.89,28.92 2.25,30.19 2.89,31.46 2.25,32.73 2.89,34 2.25,35.27 2.89,36.54 2.25,37.81 2.89,39.08 2.25,40.35 2.89,41.62 2.25,42.89 2.89,44.16 2.25,45.43 2.89,46.7 2.25,47.97 2.89,49.24 2.25,50.51 2.89,51.78 2.25,53.05 2.89,54.32 2.25,55.59 2.89,56.86 2.25,58.13 2.89,59.4 2.25,60.67 2.89,61.94 2.25,63.21 3.52,7.33 4.16,8.6 4.16,11.14 4.16,21.3 3.52,60.67 4.16,61.94 3.52,63.21 5.43,6.06 4.79,7.33 5.43,11.14 5.43,16.22 4.79,17.49 4.79,60.67 4.79,63.21 6.7,3.52 6.06,4.79 6.7,6.06 6.7,8.6 6.06,9.87 6.7,11.14 6.7,16.22 6.06,17.49 7.33,2.25 7.97,3.52 7.33,4.79 7.97,8.6 7.33,9.87 7.97,11.14 7.33,17.49 9.24,64.48 8.6,2.25 9.24,3.52 9.24,8.6 8.6,9.87 9.24,11.14 8.6,12.41 9.24,13.68 9.24,34 9.24,36.54 9.24,49.24 9.24,51.78 9.87,63.21 10.51,64.48 9.87,2.25 10.51,3.52 10.51,8.6 9.87,9.87 10.51,11.14 9.87,12.41 10.51,13.68 9.87,32.73 9.87,35.27 9.87,47.97 9.87,50.51 11.14,2.25 11.78,3.52 11.14,9.87 11.14,12.41 11.14,14.95 12.41,2.25 13.05,3.52 13.68,2.25 14.32,3.52 13.68,7.33 14.32,8.6 13.68,9.87 14.32,11.14 13.68,12.41 14.32,13.68 13.68,14.95 14.32,16.22 13.68,17.49 14.32,18.76 14.32,21.3 14.32,23.84 14.32,26.38 14.32,28.92 14.32,31.46 14.32,34 14.95,2.25 15.59,3.52 14.95,7.33 15.59,8.6 14.95,9.87 15.59,11.14 14.95,12.41 15.59,13.68 14.95,14.95 15.59,16.22 14.95,17.49 15.59,18.76 14.95,20.03 15.59,21.3 14.95,22.57 15.59,23.84 14.95,25.11 15.59,26.38 14.95,27.65 15.59,28.92 14.95,30.19 15.59,31.46 14.95,32.73 15.59,34 16.22,2.25 16.86,3.52 16.22,7.33 16.86,8.6 16.22,9.87 16.86,11.14 16.22,12.41 16.86,13.68 16.22,14.95 16.86,16.22 16.22,17.49 16.86,18.76 16.22,20.03 16.86,21.3 16.22,22.57 16.86,23.84 16.22,25.11 16.86,26.38 16.22,27.65 16.86,28.92 16.22,30.19 16.86,31.46 16.22,32.73 16.86,34 17.49,2.25 18.13,3.52 17.49,7.33 18.13,8.6 17.49,9.87 18.13,11.14 17.49,12.41 18.13,13.68 17.49,14.95 18.13,16.22 17.49,17.49 18.13,18.76 17.49,20.03 18.13,21.3 17.49,22.57 17.49,25.11 17.49,27.65 17.49,30.19 17.49,32.73 18.76,2.25 19.4,3.52 19.4,8.6 18.76,9.87 19.4,11.14 18.76,12.41 18.76,17.49 19.4,18.76 18.76,20.03 20.03,2.25 20.67,3.52 20.67,8.6 20.03,9.87 20.67,11.14 20.03,12.41 20.03,17.49 20.67,18.76 20.03,25.11 20.67,26.38 20.03,27.65 20.67,28.92 20.03,30.19 20.03,32.73 21.3,2.25 21.94,3.52 21.3,9.87 21.3,12.41 21.3,17.49 21.3,30.19 22.57,2.25 23.21,3.52 23.84,2.25 24.48,3.52 23.84,7.33 24.48,8.6 23.84,9.87 24.48,11.14 23.84,12.41 24.48,13.68 25.11,2.25 25.75,3.52 25.11,7.33 25.75,8.6 25.11,9.87 25.75,11.14 25.11,12.41 25.75,13.68 26.38,2.25 27.02,3.52 26.38,7.33 27.02,8.6 26.38,9.87 27.02,11.14 26.38,12.41 27.02,13.68 26.38,14.95 27.02,16.22 27.65,2.25 28.29,3.52 27.65,7.33 28.29,8.6 27.65,9.87 27.65,12.41 28.29,13.68 27.65,14.95 28.29,16.22 28.92,2.25 29.56,3.52 28.92,7.33 29.56,8.6 28.92,12.41 29.56,13.68 28.92,14.95 29.56,16.22 28.92,17.49 29.56,18.76 29.56,21.3 30.19,2.25 30.83,3.52 30.83,6.06 30.19,7.33 30.83,13.68 30.19,14.95 30.83,16.22 30.19,17.49 30.19,20.03 31.46,2.25 32.1,3.52 31.46,7.33 32.1,8.6 31.46,12.41 32.1,13.68 31.46,14.95 32.1,16.22 32.1,31.46 32.73,2.25 33.37,3.52 32.73,7.33 33.37,8.6 32.73,9.87 33.37,11.14 32.73,12.41 33.37,13.68 32.73,14.95 33.37,16.22 33.37,26.38 32.73,27.65 33.37,28.92 32.73,30.19 33.37,31.46 34,2.25 34.64,3.52 34,7.33 34.64,8.6 34,9.87 34.64,11.14 34,12.41 34.64,13.68 34,14.95 34.64,16.22 34,25.11 34.64,26.38 34,27.65 34.64,28.92 34,30.19 34.64,31.46 34,32.73 35.27,2.25 35.91,3.52 35.27,7.33 35.91,8.6 35.27,9.87 35.91,11.14 35.27,12.41 35.91,13.68 35.27,14.95 35.91,16.22 35.91,23.84 35.27,25.11 35.91,26.38 35.27,27.65 35.91,28.92 35.27,30.19 35.91,31.46 35.27,32.73 36.54,2.25 37.18,3.52 36.54,7.33 37.18,8.6 36.54,9.87 37.18,11.14 36.54,12.41 37.18,13.68 36.54,14.95 37.18,16.22 36.54,17.49 37.18,18.76 36.54,20.03 37.18,21.3 36.54,22.57 37.18,23.84 36.54,25.11 37.18,26.38 36.54,27.65 37.18,28.92 36.54,30.19 37.18,31.46 36.54,32.73 37.81,2.25 38.45,3.52 37.81,7.33 38.45,8.6 37.81,9.87 38.45,11.14 37.81,12.41 38.45,13.68 37.81,14.95 38.45,16.22 37.81,17.49 37.81,20.03 37.81,22.57 38.45,23.84 37.81,25.11 38.45,26.38 37.81,27.65 38.45,28.92 37.81,30.19 38.45,31.46 37.81,32.73 39.08,2.25 39.72,3.52 39.08,7.33 39.72,8.6 39.08,9.87 39.72,11.14 39.08,12.41 39.72,13.68 39.08,14.95 39.72,16.22 39.72,23.84 39.08,25.11 39.72,26.38 39.08,27.65 39.72,28.92 39.08,30.19 40.35,2.25 40.99,3.52 40.35,7.33 40.99,8.6 40.35,9.87 40.99,11.14 40.35,12.41 40.99,13.68 40.35,14.95 40.99,16.22 40.35,22.57 40.99,23.84 40.35,25.11 40.99,26.38 40.35,27.65 40.99,28.92 40.35,30.19 41.62,2.25 42.26,3.52 41.62,7.33 42.26,8.6 41.62,9.87 41.62,12.41 42.26,13.68 41.62,14.95 42.26,16.22 42.26,23.84 41.62,25.11 41.62,27.65 42.89,2.25 43.53,3.52 42.89,7.33 43.53,13.68 42.89,14.95 43.53,16.22 43.53,18.76 43.53,21.3 42.89,22.57 44.16,2.25 44.8,3.52 44.16,7.33 44.8,13.68 44.16,14.95 44.8,16.22 44.16,17.49 44.8,18.76 44.16,20.03 44.16,22.57 45.43,2.25 46.07,3.52 46.07,26.38 46.07,28.92 45.43,30.19 46.7,2.25 47.34,3.52 47.34,8.6 47.34,11.14 47.34,13.68 47.34,16.22 47.34,18.76 47.34,21.3 47.34,23.84 46.7,25.11 47.34,26.38 46.7,27.65 47.34,28.92 46.7,30.19 47.97,2.25 48.61,3.52 47.97,7.33 48.61,8.6 47.97,9.87 47.97,12.41 48.61,13.68 47.97,14.95 48.61,16.22 47.97,17.49 48.61,18.76 47.97,20.03 48.61,21.3 47.97,22.57 48.61,23.84 47.97,25.11 47.97,27.65 47.97,30.19 49.24,2.25 49.88,3.52 49.24,7.33 49.88,8.6 49.24,12.41 49.88,13.68 49.24,14.95 49.88,16.22 49.24,17.49 49.88,18.76 49.24,20.03 49.88,21.3 49.24,22.57 50.51,2.25 51.15,3.52 50.51,7.33 51.15,13.68 50.51,14.95 51.15,16.22 50.51,17.49 50.51,20.03 51.15,31.46 51.78,2.25 52.42,3.52 51.78,7.33 52.42,8.6 51.78,12.41 52.42,13.68 51.78,14.95 52.42,16.22 52.42,31.46 51.78,32.73 52.42,34 53.05,2.25 53.69,3.52 53.05,4.79 53.69,6.06 53.05,9.87 53.69,11.14 53.05,12.41 53.69,13.68 53.05,14.95 53.69,16.22 53.69,26.38 53.05,27.65 53.69,28.92 53.05,30.19 53.69,31.46 53.05,32.73 53.69,34 53.05,35.27 47.66,66.87 54.32,2.25 54.96,3.52 54.32,4.79 54.96,6.06 54.32,9.87 54.96,11.14 54.32,12.41 54.96,13.68 54.32,14.95 54.96,16.22 54.96,23.84 54.32,25.11 54.96,26.38 54.32,27.65 54.96,28.92 54.32,30.19 54.32,32.73 54.32,35.27 54.32,65.75 55.59,2.25 56.23,3.52 55.59,4.79 56.23,6.06 55.59,7.33 56.23,8.6 55.59,12.41 56.23,13.68 55.59,14.95 56.23,16.22 56.23,23.84 55.59,25.11 56.23,26.38 55.59,27.65 56.23,28.92 55.59,30.19 56.86,2.25 57.5,3.52 56.86,4.79 57.5,6.06 56.86,7.33 57.5,8.6 56.86,12.41 57.5,13.68 56.86,14.95 57.5,16.22 56.86,17.49 57.5,18.76 56.86,20.03 57.5,21.3 56.86,22.57 57.5,23.84 56.86,25.11 57.5,26.38 56.86,27.65 57.5,28.92 56.86,30.19 58.13,2.25 58.77,3.52 58.13,4.79 58.77,6.06 58.13,7.33 58.77,8.6 58.13,9.87 58.77,11.14 58.13,14.95 58.77,16.22 58.13,17.49 58.13,20.03 58.13,22.57 58.77,23.84 58.13,25.11 58.77,26.38 58.13,27.65 58.77,28.92 58.13,30.19 58.77,49.24 58.13,50.51 58.77,51.78 58.77,54.32 59.4,2.25 60.04,3.52 59.4,4.79 60.04,6.06 59.4,7.33 60.04,8.6 59.4,9.87 60.04,11.14 59.4,14.95 60.04,16.22 60.04,23.84 59.4,25.11 60.04,26.38 59.4,27.65 60.04,28.92 59.4,30.19 60.04,49.24 59.4,50.51 60.04,51.78 59.4,53.05 60.04,54.32 60.67,2.25 61.31,3.52 60.67,4.79 61.31,6.06 60.67,7.33 61.31,8.6 60.67,9.87 61.31,11.14 60.67,12.41 61.31,13.68 60.67,22.57 61.31,23.84 60.67,25.11 61.31,26.38 60.67,27.65 61.31,28.92 60.67,30.19 61.31,49.24 60.67,50.51 61.31,51.78 60.67,53.05 61.31,54.32 60.67,55.59 61.31,56.86 60.67,58.13 61.31,59.4 61.94,2.25 62.58,3.52 61.94,4.79 62.58,6.06 61.94,7.33 62.58,8.6 61.94,9.87 61.94,12.41 62.58,13.68 62.58,23.84 61.94,25.11 61.94,27.65 62.58,49.24 61.94,50.51 62.58,51.78 61.94,53.05 62.58,54.32 61.94,55.59 62.58,56.86 61.94,58.13 62.58,59.4 61.94,60.67 63.21,2.25 63.85,3.52 63.21,4.79 63.85,6.06 63.21,7.33 63.85,13.68 63.21,14.95 63.85,16.22 63.85,21.3 63.21,22.57 63.85,49.24 63.21,50.51 63.85,51.78 63.21,53.05 63.85,54.32 63.21,55.59 63.85,56.86 63.21,58.13 63.85,59.4 63.21,60.67 64.48,2.25 65.12,3.52 64.48,4.79 64.48,7.33 65.12,13.68 64.48,14.95 65.12,16.22 64.48,22.57 65.12,49.24 64.48,50.51 65.12,51.78 64.48,53.05 64.48,58.13 65.12,59.4 65.75,2.25 66.39,3.52 65.75,4.79 66.39,49.24 65.75,50.51 66.39,51.78 65.75,53.05 65.75,58.13 66.39,59.4 65.75,65.75 67.02,2.25 67.66,3.52 67.02,4.79 67.66,6.06 67.66,8.6 67.66,11.14 67.66,13.68 67.66,16.22 67.66,18.76 67.66,49.24 67.02,50.51 67.66,51.78 67.02,53.05 67.02,58.13 67.66,59.4 68.29,47.97 68.93,49.24 68.29,50.51 68.93,51.78 68.29,58.13 68.93,59.4 69.56,47.97 70.2,49.24 69.56,50.51 69.56,58.13 70.2,59.4 74.64,48.13 75.28,49.24 75.28,61.94 76.55,49.24 76.55,61.94 75.91,63.21 76.55,64.48 77.82,49.24 77.82,61.94 77.18,63.21 77.18,65.75 79.09,61.94 80.36,61.94 81.63,61.94 82.9,61.94 82.26,63.21 82.9,64.48 83.53,42.89 84.17,61.94 83.53,63.21 84.17,64.48 83.53,68.29 84.8,42.89 85.44,44.16 84.8,45.43 85.44,61.94 84.8,63.21 85.44,64.48 84.8,68.29 86.07,42.89 86.71,44.16 86.07,45.43 86.71,46.7 86.07,60.67 87.34,42.89 87.98,44.16 87.34,45.43 87.98,46.7 87.34,60.67 88.61,42.89 89.25,44.16 88.61,45.43 89.25,46.7 88.61,60.67 89.25,61.94 89.25,64.48 89.25,67.02 88.61,68.29 89.88,60.67 90.52,61.94 89.88,63.21 90.52,64.48 89.88,65.75 90.52,67.02 89.88,68.29 91.15,60.67 91.79,61.94 91.15,63.21 91.79,64.48 91.15,65.75 91.79,67.02 91.15,68.29 93.06,46.7 93.06,59.4 92.42,60.67 93.06,61.94 92.42,63.21 93.06,64.48 92.42,65.75 93.06,67.02 92.42,68.29 93.69,58.13 94.33,59.4 93.69,60.67 94.33,61.94 93.69,63.21 94.33,64.48 93.69,65.75 94.33,67.02 93.69,68.29 94.96,60.67 95.6,61.94 94.96,63.21 95.6,64.48 94.96,65.75 95.6,67.02 94.96,68.29 96.23,42.89 96.87,44.16 96.23,45.43 96.87,46.7 96.87,61.94 96.23,63.21 96.87,64.48 96.23,65.75 96.87,67.02 96.23,68.29 97.5,42.89 98.14,44.16 97.5,45.43 98.14,46.7 97.5,63.21 97.5,65.75 97.5,68.29 98.77,42.89 99.41,44.16 98.77,45.43 99.41,46.7 100.04,42.89 100.68,44.16 100.04,45.43 100.68,46.7 100.04,55.59 101.31,42.89 101.31,45.43 101.31,55.59 102.58,42.89 103.85,42.89 105.12,42.89 105.76,44.16 105.76,46.7 105.76,49.24 106.39,42.89 107.03,44.16 106.39,45.43 107.03,46.7 106.39,47.97 107.03,49.24 107.03,51.78 107.51,54.17 106.87,60.36 108.3,36.54 108.3,44.16 107.66,45.43 107.66,47.97 107.66,50.51 107.66,53.05 108.93,35.27 109.57,36.54 108.93,37.81 109.57,49.24 109.57,51.78 110.2,35.27 110.84,36.54 110.2,47.97 110.84,49.24 110.2,50.51 110.84,51.78 110.2,63.21 110.84,64.48 110.2,65.75 110.84,67.02 110.2,68.29 112.11,61.94 111.47,63.21 112.11,64.48 111.47,65.75 112.11,67.02 111.47,68.29 112.74,22.57 113.38,23.84 113.38,59.4 112.74,60.67 113.38,61.94 112.74,63.21 113.38,64.48 112.74,65.75 113.38,67.02 112.74,68.29 114.01,22.57 114.65,23.84 114.01,25.11 114.01,58.13 114.65,59.4 114.01,60.67 114.65,61.94 114.01,63.21 114.65,64.48 115.28,22.57 115.92,23.84 115.28,25.11 115.92,26.38 115.28,27.65 115.92,28.92 115.28,30.19 115.92,31.46 115.28,32.73 115.92,34 115.28,35.27 115.92,36.54 115.28,37.81 115.92,39.08 115.28,40.35 115.92,41.62 115.28,42.89 115.92,44.16 115.92,46.7 115.92,49.24 115.92,51.78 115.92,54.32 115.92,56.86 115.28,58.13 115.92,59.4 115.28,60.67 115.92,61.94 115.28,63.21 116.55,22.57 117.19,23.84 116.55,25.11 117.19,26.38 116.55,27.65 117.19,28.92 116.55,30.19 117.19,31.46 116.55,32.73 117.19,34 116.55,35.27 117.19,36.54 116.55,37.81 117.19,39.08 116.55,40.35 117.19,41.62 116.55,42.89 117.19,44.16 116.55,45.43 117.19,46.7 116.55,47.97 117.19,49.24 116.55,50.51 117.19,51.78 116.55,53.05 117.19,54.32 116.55,55.59 117.19,56.86 116.55,58.13 117.19,59.4 116.55,60.67 117.19,61.94 116.55,63.21 117.82,22.57 117.82,25.11 117.82,27.65 117.82,30.19 117.82,32.73 117.82,35.27 117.82,37.81 117.82,40.35 117.82,42.89 117.82,45.43 117.82,47.97 117.82,50.51 117.82,53.05 117.82,55.59 117.82,58.13 117.82,60.67 117.82,63.21 96.23,50.51 96.87,51.78 96.23,53.05 97.5,50.51 98.14,51.78 97.5,53.05 98.77,50.51 99.41,51.78 98.77,53.05 100.04,50.51 100.68,51.78 101.31,50.51 89.88,50.51 90.52,51.78 91.15,50.51 91.79,51.78 92.42,50.51 93.06,51.78 93.69,50.51 94.33,51.78 94.96,50.51 42.89,34 108.93,32.1 110.2,32.1 108.3,30.83 108.93,29.56 109.57,34 110.84,34 75.91,48.13 77.18,48.13
  pour Top: -2,72 -2,-2 68.25,-2 68.25,40.08 108.26,40.08 108.26,21.03 122,21.03 122,72
  pour Bottom: -1,71 -1,-1 68.25,-1 68.25,40.08 108.26,40.08 108.26,21.03 121,21.03 121,71
HOLE1  (via drill 3.2 pad 5.5)
  other vias: 3,67
HOLE2  (via drill 3.2 pad 5.5)
  other vias: 3,3
HOLE3  (via drill 3.2 pad 5.5)
  other vias: 117,67
HOLE4  (via drill 3.2 pad 5.5)
  other vias: 117,3
INPUT_PWR  (5 unrouted)
  Top 1.27: C5.1 45,39.13 45.27,38.91 45.27,37.54 | R3.2 48.57,31.82 49.79,33.05 Q1.3 | R5.2 19.58,47
  Top 2.54: 47.88,42.12 45.38,39.62 45,39.13 | 47.88,42.12 47.88,45 Q4.3 47.38,46.25 44.38,49.25 38.5,49.25 33.12,54.62 Q3.4 21.86,45.11 Q5.3 19.95,45.11 19.9,45.16 | Q1.3 50.12,34.88 50.12,35.25 53.25,38.38 53.25,40.5 51.88,41.88 49.12,41.88 47.88,42.12 | 23.75,48.2 23.45,48.5 15,48.5 14.12,47.62 14.12,42.62 16.5,40.25 18.62,40.25 F5.1
LED_BATT
  Top 0.254: 46.05,7.88 46.05,19.45 46.12,19.5 R2.1 | 46.05,7.88 46.05,7.8 | LED2.A 46.12,7.88 46.05,7.88
LED_DCDCOUT
  Top 0.254: LED5.A 4.91,19.11 10.16,19.11 R18.1
LED_FT232RL_RX
  Top 0.254: LED4.C 96.88,5.38 96.88,8.75 R7.2
LED_FT232RL_TX
  Top 0.254: LED3.C 93,5.38 93,8.75 R6.2
LED_PWR
  Top 0.254: 66.4,7.88 66.4,19.45 66.38,19.5 R1.1 | 66.4,7.88 66.4,7.8 | LED1.A 66.38,7.88 66.4,7.88
LED_SERVO
  Top 0.254: LED7.A 10.65,66.12 11.83,66.12 R20.1
LED_USBIN
  Top 0.254: LED6.A 89.25,5.38 89.25,8.75 R19.1
LTC1480_DI
  Top 0.203: R8.2 74.62,30.25 74.62,29.25 75.88,28 IC3.4
LTC1480_VCC
  Top 0.254: 82.12,32 84.12,32 R11.1 | 82.12,32 81,32 R10.2 | 82,24.62 81.25,24.62 79.75,23.12 IC3.8 | 82,24.62 C10.1 | 82.12,32 82.12,27.12 82,27 82,24.62
LTC4412_GATE  (via drill 0.35)
  Top 0.508: v43.77,32.85 44.12,33.21 44.12,35.75 44.62,36.25 45.25,36.25 IC4.5 | v38.75,34.12 36.12,34.12 36,34.25 Q2.1 | v34.5,38.12 34.12,38.12 32.88,39.38 32.88,40.38 29.62,43.62 29.62,45 Q3.1
  Bottom 0.508: v43.77,32.85 40.02,32.85 v38.75,34.12 38.5,34.12 v34.5,38.12
LTC4412_STAT
  Top 0.508: R3.1 45.25,31.88 45.25,35.25 IC4.4 45.5,35.38 46,35.38 49.75,39.12 49.75,39.38 Q1.1
POWER_OUTPUT  (via drill 0.35)
  Top 1.143: v25.38,30.75 22.62,28 22.62,23 CH5.2 | v56.38,55.88 57.25,55.88 59.12,57.75 F7.1
  Bottom 1.143: v25.38,30.75 50.5,55.88 v56.38,55.88
REXT_FE1.1S  (via drill 0.35)
  Top 0.203: v103.12,27.88 104,27 104,26.75 R15.2 | v86.25,29.75 86.25,26.75 89.38,23.62 IC1.14
  Bottom 0.203: v103.12,27.88 102,29 96.51,29 94.76,30.75 87.25,30.75 v86.25,29.75
RS485_D+  (via drill 0.35)
  Top 0.203: CH8.3 9.25,55.88 9.25,55 10.88,53.38 10.88,42.38 9.25,40.75 CH9.3 9.25,40.62 10.88,39 10.88,27.38 9.25,25.75 9.25,25.5 CH10.3 9.12,25.38 9.12,24.62 4.12,19.62 4.12,17.38 3,16.25 3,11.25 9,5.25 51.62,5.25 65.38,19 65.38,20.12 65.62,20.38 67.12,20.38 74.44,27.69 | CH12.3 110.75,43.25 110.75,44.25 109.12,45.88 109.12,56.75 110.75,58.38 CH11.3 | R12.1 82.99,34.37 82.88,34.25 D9.1 82.75,34.25 82,34.25 81.89,34.37 R13.2 81.12,34.37 81.12,36.62 80.94,36.81 | 74.44,27.69 73.5,28.62 73.5,36.1 75.52,38.12 79.62,38.12 80.94,36.81 | 74.44,27.69 77.12,25 77.12,23.12 IC3.6 | CH13.3 107.94,28 106,29.94 106,34.62 103.44,37.19 | 103.44,37.19 103.25,37.38 81.5,37.38 80.94,36.81 | 103.44,37.19 v104.88,38.62
  Bottom 0.203: v104.88,38.62 109.12,42.88 109.38,42.88 109.75,43.25 110.75,43.25 CH12.3
RS485_D-  (via drill 0.35)
  Top 0.203: CH10.4 9.25,23 9.25,24 11.62,26.38 v11.62,35.88 16.38,35.88 19,38.5 19.75,38.5 20.88,39.62 20.88,42.38 21.38,42.88 24.38,42.88 28.88,47.38 43.62,47.38 v44,47 | D8.1 77.88,34.25 78.62,34.25 78.74,34.37 R13.1 79.25,34.37 v79.25,36.88 | R14.2 77.64,34.37 77.75,34.25 D8.1 | IC3.7 78.38,23.12 78.38,25 76.5,26.88 76.5,32.88 77.75,34.12 D8.1 | v115,43.88 115,55.88 110.88,60 110.88,60.88 CH11.4
  Bottom 0.203: 11.06,36.44 9.25,38.25 CH9.4 | 11.06,36.44 v11.62,35.88 | 11.06,36.44 11.88,37.25 11.88,50.75 9.25,53.38 CH8.4 | 112.69,32.31 113.5,33.12 113.5,42.25 113.44,42.31 | 112.69,32.31 110.88,30.5 CH13.4 | 113.44,42.31 111.62,44.12 111.5,44.12 110.88,44.75 110.88,45.62 CH12.4 | 113.44,42.31 v115,43.88 | 79.7,37.33 79.73,37.38 105.15,37.38 109.38,33.12 111.88,33.12 112.69,32.31 | 79.7,37.33 v79.25,36.88 | v44,47 60,47 67.88,39.12 77.9,39.12 79.7,37.33
SOURCE
  Top 2.54: Q3.3 34.62,45 34.62,40.75 35.88,39.5 Q2.3
SW_DCDC  (via drill 0.35)
  Top 1.143: v70.5,52.38 67.62,55.25 L1.1 | 80.32,50.62 v74.75,50.62 | 80.95,55.57 80.38,55.62 VR1.6 | C21.2 87.62,57.75 83,57.75 81.5,56.25 VR1.6 | 80.32,54.09 80.62,54.62 VR1.6
  Top 1.27: 80.32,54.48 80.32,54.09 80.32,50.62 80.32,46.09 VR1.3 80.32,45.8 | 80.95,55.12 80.95,55.57 80.95,55.64 80.95,55.95
  Bottom 1.143: v70.5,52.38 73,52.38 v74.75,50.62
TF232RL_RX_LED  (via drill 0.35)
  Top 0.254: v93.38,12 94.88,10.5 96.75,10.5 R7.1 | v89.88,25.5 91.5,25.5 92,26 92,27 IC2.22
  Bottom 0.254: v93.38,12 93.38,12.38 88.56,17.19 88.56,24.44 88.12,24.88 88.12,25.62 88.5,26 89.38,26 v89.88,25.5
USB-HUB_1_D+  (via drill 0.35)
  Top 0.203: v93.5,25.5 92.38,25.5 91.5,24.62 91.5,23.75 IC1.11 | v87.62,28.5 87.62,27.12 IC2.15
  Bottom 0.203: v93.5,25.5 93.5,28.75 93,29.25 88.38,29.25 v87.62,28.5
USB-HUB_1_D-  (via drill 0.35)
  Top 0.203: v91.75,22.38 92,22.62 92,23.62 IC1.10 | v88.88,25.25 88.25,25.88 88.25,27 IC2.16
  Bottom 0.203: v88.88,25.25 v91.75,22.38
USB-HUB_2_D+  (via drill 0.35)
  Top 0.203: D4.1 74,19.5 75.12,19.5 76.62,18 77.75,18 78.62,17.12 78.62,16.12 USB2.2 | v91.88,21.38 92.62,22.12 92.62,23.62 IC1.9 | v89.88,21 85.25,21 84.62,20.38 83.5,20.38 v83.12,20.75
  Bottom 0.203: v91.88,21.38 91.5,21 v89.88,21 | v83.12,20.75 80,17.62 79.88,17.62 78.75,16.5 78.75,16.12 USB2.2
USB-HUB_2_D-  (via drill 0.35)
  Top 0.203: D5.1 76.62,19.5 77.25,19.5 80.62,16.12 USB2.3 | v92.88,21.38 93.25,21.75 93.25,23.62 IC1.8
  Bottom 0.203: v92.88,21.38 92.88,23.5 89.88,26.5 88.38,26.5 83.88,22 83.88,20.25 80.88,17.25 80.88,16.25 80.75,16.12 USB2.3
USB-HUB_3_D+  (via drill 0.35)
  Top 0.203: v80.25,19.62 81.5,19.62 D6.1 | v77.5,17.25 77.5,14.62 78.62,13.5 USB2.6 | v94.5,25.5 94,25 94,23.75 IC1.7
  Bottom 0.203: v77.5,17.25 78,17.75 78.38,17.75 v80.25,19.62 80.25,22.12 87.88,29.75 93.12,29.75 94.5,28.38 v94.5,25.5
USB-HUB_3_D-  (via drill 0.35)
  Top 0.203: USB2.7 80.75,13.5 81.88,14.62 81.88,16.75 79.12,19.5 D7.1 79,19.62 78.25,20.38 v78,20.38 | v94.25,29.62 95.63,29.62 96.62,28.63 96.62,26.12 96.38,25.88 95.88,25.88 94.62,24.62 IC1.6
  Bottom 0.203: v94.25,29.62 93.62,30.25 87.75,30.25 78,20.5 v78,20.38
USB_A_SHIELD
  Top 0.254: USB2.MH3 73.12,10.62 73.12,16.12 USB2.MH1 73.12,16.25 73.12,20.38 73.88,21.12 D4.2 74,21.25 76.5,21.25 D5.2 76.62,21.25 79,21.25 D7.2 79.12,21.25 81.5,21.25 D6.2 81.62,21.12 83,19.75 84.12,19.75 FL1.1 84.25,19.62 84.25,18.25 86.25,16.25 USB2.MH2 86.38,16.12 86.38,10.62 USB2.MH4
USB_IN_D+  (via drill 0.35)
  Top 0.203: v110.38,12.5 112,12.5 D2.1 | v91.75,15.75 90.25,17.25 90.25,18.25 IC1.16
  Bottom 0.203: v110.38,12.5 109.25,13.62 99.5,13.62 96.19,10.31 | 96.19,10.31 95.5,9.62 95.5,8.62 USB1.3 | v91.75,15.75 91.75,14.62 95.88,10.5 96,10.5 96.19,10.31
USB_IN_D-  (via drill 0.35)
  Top 0.203: v98.5,11.5 98.5,11 99.88,9.62 101.25,9.62 102.88,8 102.88,5.5 103.88,4.5 108.75,4.5 109,4.75 109,7.25 111.38,9.62 112.75,9.62 114.5,11.38 114.5,12.5 D3.1 | v90.38,12.62 89.5,13.5 89.5,18.25 IC1.15
  Bottom 0.203: v98.5,11.5 97.5,10.5 97.12,10.5 96.25,9.62 96.25,8.62 USB1.2 96.38,8.5 96.5,8.38 96.5,7.5 95.5,6.5 93.38,6.5 92.88,7 92.88,10.12 v90.38,12.62
USB_MINI_B_SHIELD  (via drill 0.35)
  Top 0.254: FL2.1 117.12,12.75 116,12.75 114.62,14.12 D3.2 114.5,14.25 112.12,14.25 D2.2 112,14.25 111.12,14.25 109.88,15.5 104.12,15.5 102.5,13.88 v102.5,12.12
  Bottom 0.254: USB1.MP2 91.12,8.38 91.12,3 USB1.MP3 91.25,3.88 100,3.88 USB1.MP4 100.12,3 100.12,8.38 USB1.MP1 100,8.5 100,9.62 v102.5,12.12
VD18  (via drill 0.35)
  Top 0.254: C12.1 104.12,34.25 104.12,32 105,31.12 105,17.88 103.5,16.38 99.75,16.38 97.88,18.25 IC1.28 97.75,18.38 97.75,19.25 97.62,19.38 v97.62,19.75 | v96.25,20.62 91.5,20.62 91.12,21 91.12,21.62 90.75,22 90.75,23.62 IC1.12
  Bottom 0.254: v96.25,20.62 96.75,20.62 v97.62,19.75
VD33  (via drill 0.35)
  Top 0.254: IC1.13 90.12,23.62 90.12,21.88 90.62,21.38 90.62,19.38 90.88,19.12 90.88,18.5 IC1.17 90.88,18.38 91.38,18.38 IC1.18 91.5,18.38 92,18.38 IC1.19 92,18.5 92,19.12 92.38,19.5 93,19.5 93.25,19.25 | 93.25,19.25 93.25,18.38 IC1.21 | v101.38,25.62 101.38,27.38 104,30 104,30.5 C11.1 | v99.88,22.75 99.5,22.75 96.5,19.75 96.5,19.5 | 96.5,19.5 96.5,18.38 IC1.26 | 96.5,19.5 93.62,19.5 93.38,19.25 93.25,19.25
  Bottom 0.254: v101.38,25.62 101.38,24.25 v99.88,22.75
XIN_FE1.1S
  Top 0.203: CR1.1 101.12,21.5 101.12,23.5 C15.1 101,23.5 99.62,23.5 98.75,22.62 96.88,22.62 96.62,22.88 96.62,23.62 IC1.3
XOUT_FE1.1S
  Top 0.203: C16.1 102.75,17.25 102.75,19.25 CR1.3 102.75,19.38 103.62,20.25 103.62,24.25 103,24.88 97.5,24.88 97.25,24.62 97.25,23.75 IC1.2

### Text on the board
tPlace: Servo Fuse | CPU Fuse | G | D- | V | D+ | D+ | V | D- | G | G | D- | V | D+ | D+ | V | D- | G | Battery Fuse | Power Fuse | G | D- | V | D+ | D+ | V | D- | G | Power Output | CPU Power | VoltageMeter | USB / PWR | Servo / TX | Servo / RX | HUB / Out1 | HUB / Out2 | HUB / Out3 | HUB / Active | ServoPower / Switch | JetsonPower / Switch | ^Battery Input | ^Power Input (Priority)
bPlace: Servo 1 | Servo 4 | Servo 2 | Servo 5 | RoboCup Soccer Humanoid Team / CIT Brains http://www.cit-brains.net/ / / GankenKun MainBoard Ver2.1 / for EN715 carrier board with NVIDIA Jetson Xavier NX Module / / Designed by Masato Kubotera on Februaty 20, 2022. / / Check lists / [ ] No Short Circuit / [ ] Two power switching / [ ] ON/OFF switching / [ ] Buck-Boost Converter / [ ] USB-HUB / [ ] USB-RS485 | Servo 3 | Servo 6